# Altium schematic sheet arksigner1.SchDoc
size A4; SheetNumber: 1; SheetTotal: 1
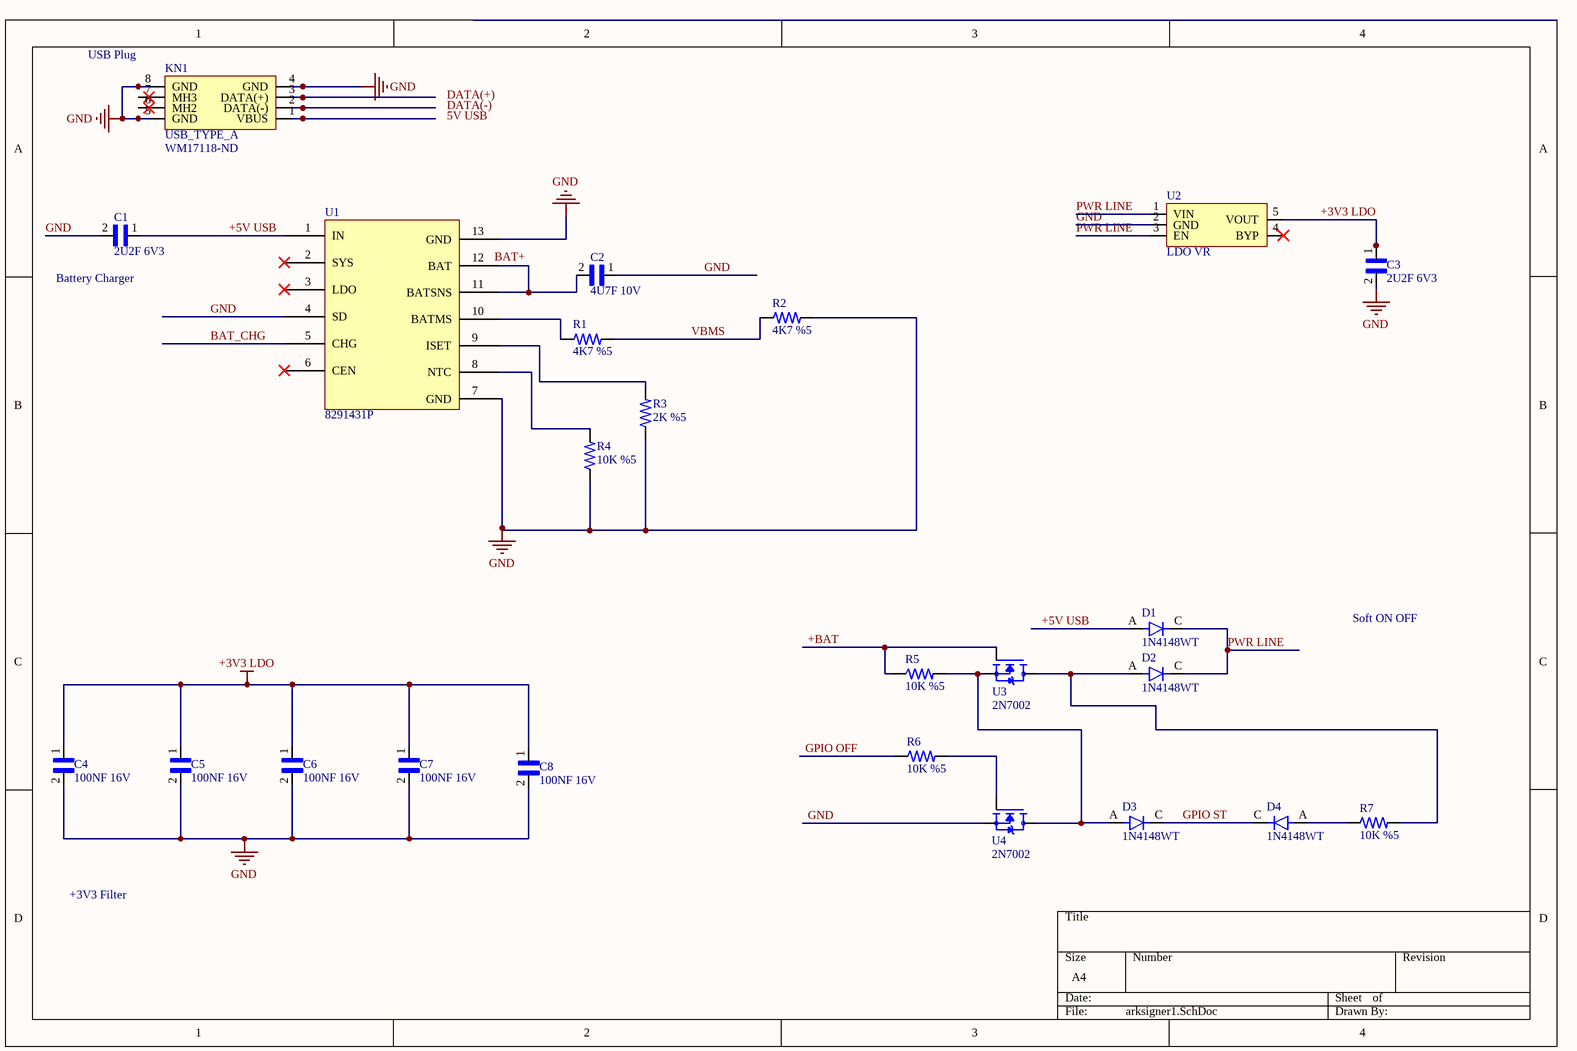
[diagram p0: arksigner1.SchDoc]

## Parts
C1  2U2F 6V3  [CAP]
C2  4U7F 10V  [CAP]
C3  2U2F 6V3  [CAP]
C4  100NF 16V  [CAP]
C5  100NF 16V  [CAP]
C6  100NF 16V  [CAP]
C7  100NF 16V  [CAP]
C8  100NF 16V  [CAP]
D1  1N4148WT  [SODFL1608X70N]
D2  1N4148WT  [SODFL1608X70N]
D3  1N4148WT  [SODFL1608X70N]
D4  1N4148WT  [SODFL1608X70N]
KN1  USB_TYPE_A  Supplier Part Number 1: WM17118-ND
R1  4K7 %5  [RES]
R2  4K7 %5  [RES]
R3  2K %5  [RES]
R4  10K %5  [RES]
R5  10K %5  [RES]
R6  10K %5  [RES]
R7  10K %5  [RES]
U1  Supplier Part Number 1: 8291431P  (hidden comment: STNS01)
U2  LDO VR
U3  2N7002  [SOT95P240X111-3N]
U4  2N7002  [SOT95P240X111-3N]

## Nets
+3V3 LDO: C3.1 C4.1 C5.1 C6.1 C7.1 C8.1 U2.5(VOUT)
GND: C1.2 C2.1 C3.2 C4.2 C5.2 C6.2 C7.2 C8.2 KN1.4(GND) KN1.5(GND) KN1.8(GND) R2.2 R3.1 R4.1 U1.4(SD) U1.7(GND) U1.13(GND) U2.2(GND) U4.2(S)
+5V USB: C1.1 D1.A U1.1(IN)
+BAT: R5.1 U3.1(G)
BAT_CHG: U1.5(CHG)
GPIO OFF: R6.1
GPIO ST: D3.C D4.C
PWR LINE: D1.C D2.C U2.1(VIN) U2.3(EN)
VBMS: R1.2 R2.1
NetC2_2: C2.2 U1.11(BATSNS) U1.12(BAT)
NetD2_A: D2.A R7.2 U3.3(D)
NetD3_A: D3.A R5.2 U3.2(S) U4.3(D)
NetD4_A: D4.A R7.1
NetR1_1: R1.1 U1.10(BATMS)
NetR3_2: R3.2 U1.9(ISET)
NetR4_2: R4.2 U1.8(NTC)
NetR6_2: R6.2 U4.1(G)

Not connected (* = marked no-connect by the designer): KN1 1(VBUS) 2(DATA(-)) 3(DATA(+)) 6(MH2) 7(MH3); U1 2(SYS)* 3(LDO)* 6(CEN)*; U2 4(BYP)*

## Notes on the sheet
- (near KN1) USB Plug
- (near C1) Battery Charger
- Soft ON OFF
- +3V3 Filter
- Labels drawn without touching a wire or pin: 5V USB, BAT+, DATA(+), DATA(-)

## Library data of the parts
C1-C8 = 06035J6R8BBSTR: RF/Microwave Capacitor; Capacitance:6.8pF; Capacitance Tolerance:Â± 0.1pF; Series:Accu-P; Voltage Rating:50VDC; Capacitor Dielectric Type:Thin Film; Package/Case:0603; Termination Type:SMD; Leaded Process Compatible:Yes ;RoHS Compliant: Yes; Package: None; Price: None; Value: *; MP: 06035J6R8BBSTR; Availability: Unavailable
D1-D4 = 1N4148WT: Diode Standard 100V 150mA Surface Mount SOD-123; MP: 1N4148W+; MF: Micro Commercial; Package: SOD-123 Multicomp; Value: *; Availability: Unavailable; Price: None; SnapEDA_Link: https://www.snapeda.com/parts/1N4148W%2B/Micro%20Commercial/view-part/2755184/?ref=snap
KN1 = USB_TYPE_A: Conn USB 2.0 Type A PL 4 POS Solder RA SMD 4 Terminal 1 Port Tray; Manufacturer: Molex; Manufacturer Part Number: 0480371000; Number of Terminals/Pins: 4; Number of Ports: 1; Max Voltage Rating (AC): 150V; Supplier 1: Digi-Key; RoHS: Yes; Category: Connectors; Stock 1: 23319; Pricing 1: 1=1,33000, 10=1,09800, 230=0,91526, 1000=0,73221, 3000=0,66356 (USD); Mount: Surface Mount,Horizontal; Contact Material: Brass; Contact Plating: Gold; Housing Material: Thermoplastic; Min Operating Temperature: -20°C; Max Operating Temperature: 85°C; Packaging: Tray; Package Quantity: 1000; Connector Type: USB; Number of Contacts: 4; Termination: Solder; Orientation: Right Angle; Series: -; Features: Shielded; Length: 12.7mm; Depth: 18.8mm; RoHS Compliant: Yes; ComponentLink1URL: https://datasheet.ciiva.com/15181/getdatasheetpartid-168028-15181217.pdf?src-supplier=Verical; ComponentLink1Description: https://datasheet.ciiva.com/15181/getdatasheetpartid-168028-15181217.pdf?src-supplier=Verical; ComponentLink2URL: https://datasheet.ciiva.com/851/480371000-sd-851331.pdf?src-supplier=Digi-Key; ComponentLink2Description: https://datasheet.ciiva.com/851/480371000-sd-851331.pdf?src-supplier=Digi-Key; ComponentLink3URL: https://datasheet.ciiva.com/3897/88000480371000-io-nectors-3897640.pdf?src-supplier=Arrow+Electronics; ComponentLink3Description: https://datasheet.ciiva.com/3897/88000480371000-io-nectors-3897640.pdf?src-supplier=Arrow+Electronics
R1-R7 = 8-1676481-3: RES SMD 22K OHM 0.1% 1/16W 0603; MF: TE Connectivity; Voltage_Rating: 50 V; Power_Rating: .063 W; Tolerance: .1%; EU_RoHS_Compliance: Compliant; SnapEDA_Link: https://www.snapeda.com/parts/8-1676481-3/TE%20Connectivity/view-part/2208246/?ref=snap; Resistance: 22K; Package: 0603; Price: None; MP: 8-1676481-3; Availability: Warning; Value: *
U1 = STNS01: IC LI-ION BATT CHARGER LDO 12DFN; Manufacturer: STMicroelectronics; Manufacturer Part Number: STNS01PUR; Output Voltage: 3.1V; Output Current: 200mA; Min Supply Voltage: 4.55V; Max Supply Voltage: 5.4V; Operating Supply Current: 1.4mA; Number of Cells: 1; Max Output Voltage: 3.193V; Min Output Voltage: 3.007V; Max Charge Current: 400mA; ComponentLink1Description: New link; ComponentLink1URL: *; Supplier 1: RSComponents; RoHS: Yes; Category: Battery Management; Stock 1: 1; Pricing 1: 5=2,20000, 10=1,87200, 100=1,30300, 500=1,26400 (USD); Mount: Surface Mount; Case/Package: DFN; Number of Pins: 12; Contact Plating: Tin,Matte; Min Operating Temperature: -40°C; Max Operating Temperature: 85°C; Packaging: Tape and Reel; Package Quantity: 3000; Max Output Current: 200mA; Length: 3.15mm; Width: 3.15mm; Height: 0.75mm; Radiation Hardening: No; REACH SVHC: No SVHC; Lead Free: Lead Free; RoHS Compliant: Yes; ComponentLink2URL: https://datasheet.ciiva.com/18617/dm00085223-18617622.pdf?src-supplier=Digi-Key; ComponentLink2Description: https://datasheet.ciiva.com/18617/dm00085223-18617622.pdf?src-supplier=Digi-Key; ComponentLink3URL: https://datasheet.ciiva.com/24021/dm00085223-24021750.pdf?src-supplier=Mouser; ComponentLink3Description: https://datasheet.ciiva.com/24021/dm00085223-24021750.pdf?src-supplier=Mouser; ComponentLink4URL: https://datasheet.ciiva.com/41458/001184952-da-01-en-ic-li-ion-batt-char-stns01pur-dfn-12-stm-41458066.pdf?src-supplier=Conrad; ComponentLink4Description: https://datasheet.ciiva.com/41458/001184952-da-01-en-ic-li-ion-batt-char-stns01pur-dfn-12-stm-41458066.pdf?src-supplier=Conrad; ComponentLink5URL: https://datasheet.ciiva.com/18617/dm00085223-18617623.pdf?src-supplier=Digi-Key; ComponentLink5Description: https://datasheet.ciiva.com/18617/dm00085223-18617623.pdf?src-supplier=Digi-Key; ComponentLink6URL: https://datasheet.ciiva.com/18617/dm00085223-18617624.pdf?src-supplier=Digi-Key; ComponentLink6Description: https://datasheet.ciiva.com/18617/dm00085223-18617624.pdf?src-supplier=Digi-Key
U2 = LDO VR: IC REG LDO 3.3V 0.15A SOT23-5; Manufacturer: Microchip; Manufacturer Part Number: MIC5205-3.3BM5TR; Supplier 1: Arrow Electronics; RoHS: Yes; Category: Voltage Regulators - Linear; ComponentLink1URL: https://datasheet.ciiva.com/2071/mic5205-2071755.pdf?src-supplier=Digi-Key; ComponentLink1Description: https://datasheet.ciiva.com/2071/mic5205-2071755.pdf?src-supplier=Digi-Key
U3 U4 = 2N7002: N-Channel 60V 280mA (Ta) 350mW (Ta) Surface Mount SOT-23-3 (TO-236); MF: ON Semiconductor; SnapEDA_Link: https://www.snapeda.com/parts/2N7002/ON%20Semiconductor/view-part/4449003/?ref=snap; Purchase-URL: https://pricing.snapeda.com/search/part/2N7002/?ref=eda; Value: *; MP: 2N7002; Availability: In Stock; Check_prices: https://www.snapeda.com/parts/2N7002/ON%20Semiconductor/view-part/4449003/?ref=eda; Package: SOT-23 Multicomp; Price: None